# EAGLE design ARTIC_R2 (EAGLE 9.6.2)
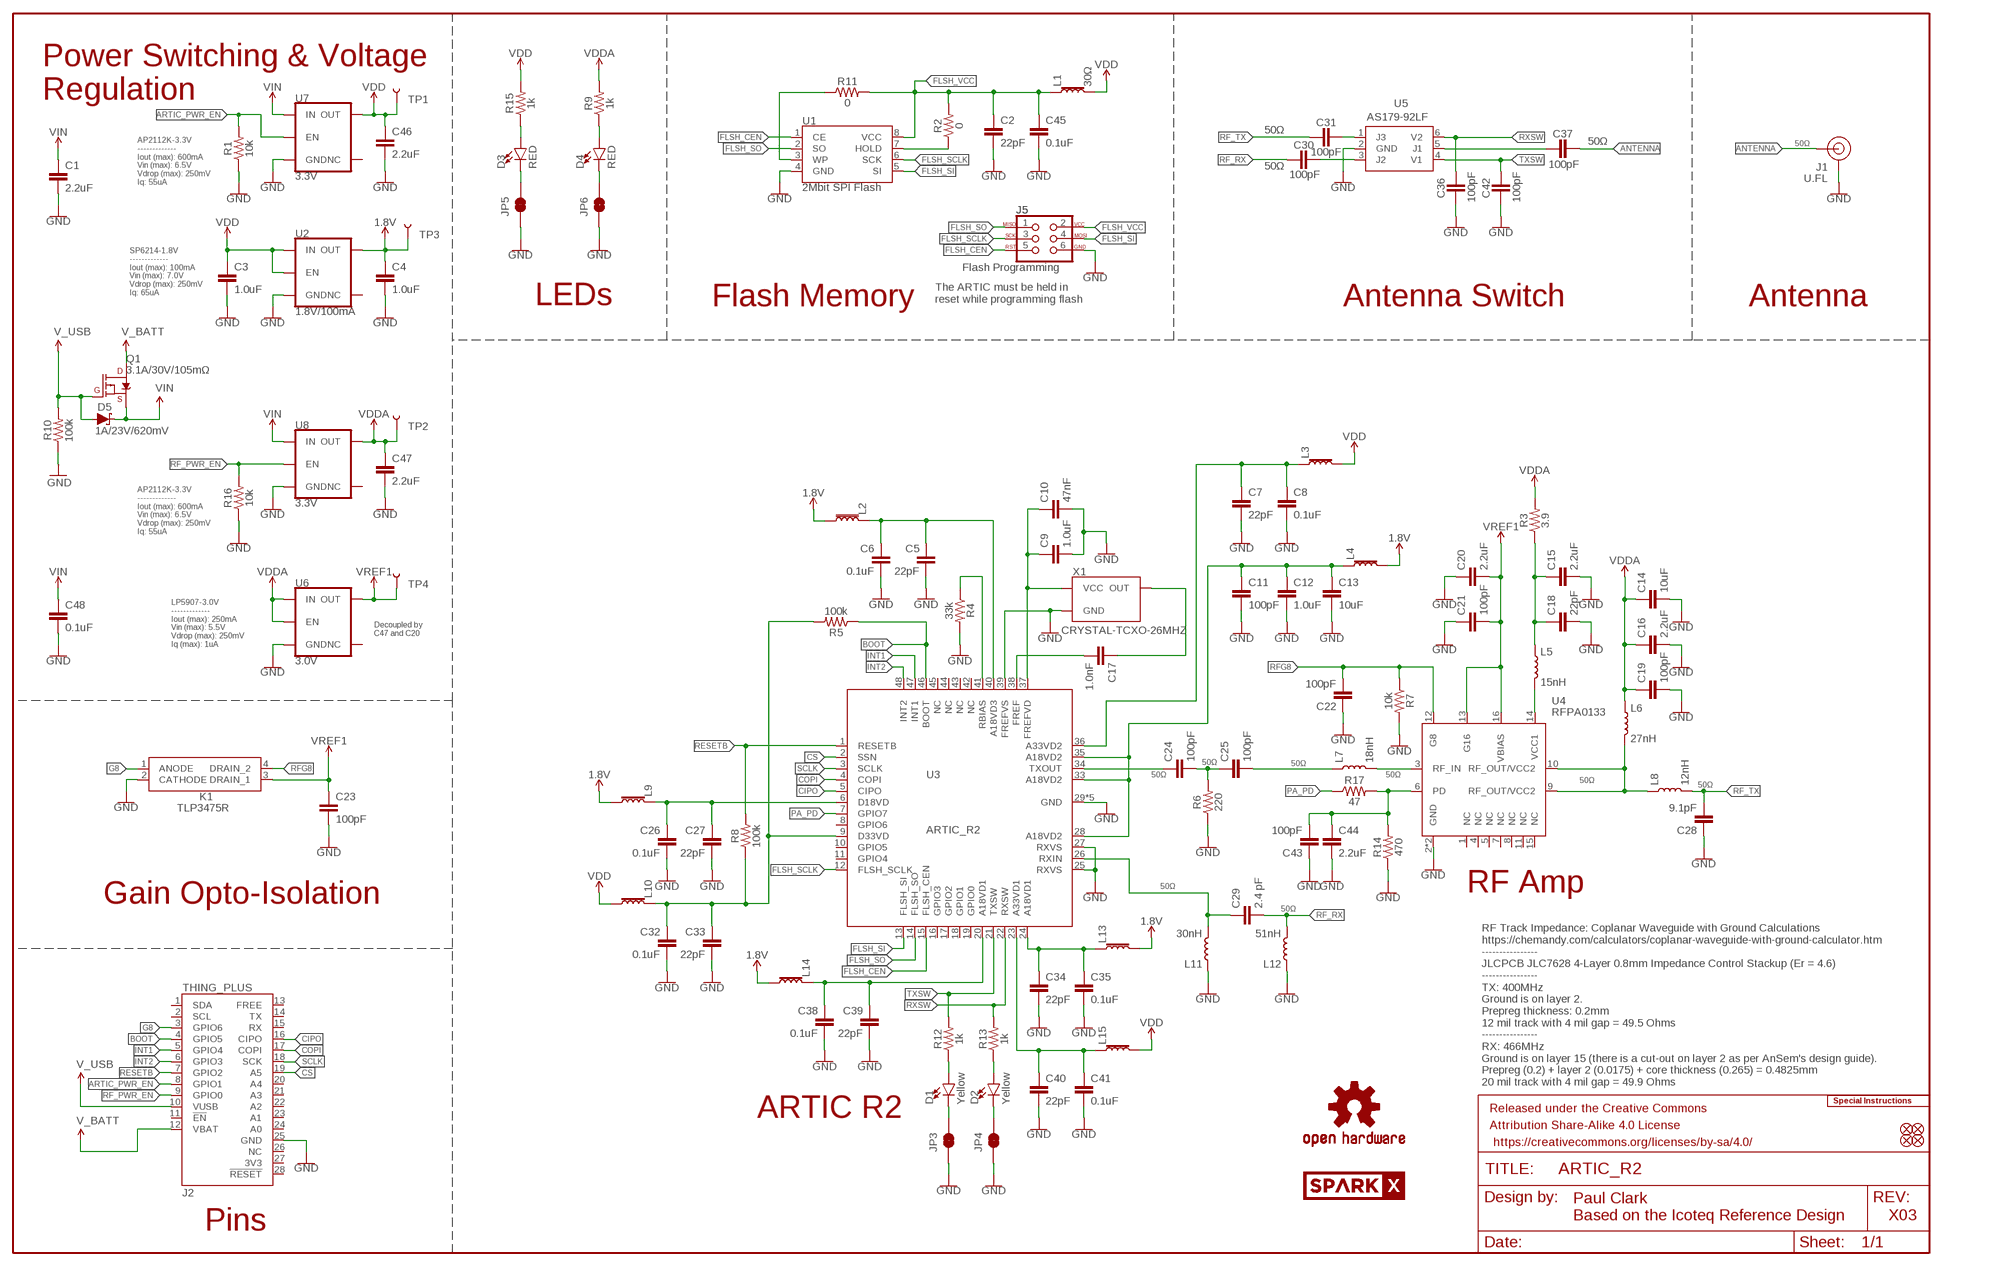
[diagram p0: schematic, sheet 1]

## Parts
C1  2.2uF  2.2UF-0402_TIGHT-10V-10%-X5R  [0402-TIGHT]
C2  22pF  22PF-0402T-16V-10%  [0402-TIGHT]
C3  1.0uF  1.0UF-0402T-16V-10%  [0402-TIGHT]
C4  1.0uF  1.0UF-0402T-16V-10%  [0402-TIGHT]
C5  22pF  22PF-0402T-16V-10%  [0402-TIGHT]
C6  0.1uF  0.1UF-0402T-6.3V-10%-X7R  [0402-TIGHT]
C7  22pF  22PF-0402T-16V-10%  [0402-TIGHT]
C8  0.1uF  0.1UF-0402T-6.3V-10%-X7R  [0402-TIGHT]
C9  1.0uF  1.0UF-0402T-16V-10%  [0402-TIGHT]
C10  47nF  47NF-0402_TIGHT-25V-10%-X7R  [0402-TIGHT]
C11  100pF  100PF-0402T-50V-5%  [0402-TIGHT]
C12  1.0uF  1.0UF-0402T-16V-10%  [0402-TIGHT]
C13  10uF  10UF-0402T-6.3V-20%  [0402-TIGHT]
C14  10uF  10UF-0402T-6.3V-20%  [0402-TIGHT]
C15  2.2uF  2.2UF-0402_TIGHT-10V-10%-X5R  [0402-TIGHT]
C16  2.2uF  2.2UF-0402_TIGHT-10V-10%-X5R  [0402-TIGHT]
C17  1.0nF  1.0NF/1000PF-0402_TIGHT-50V-10%  [0402-TIGHT]
C18  22pF  22PF-0402T-16V-10%  [0402-TIGHT]
C19  100pF  100PF-0402T-50V-5%  [0402-TIGHT]
C20  2.2uF  2.2UF-0402_TIGHT-10V-10%-X5R  [0402-TIGHT]
C21  100pF  100PF-0402T-50V-5%  [0402-TIGHT]
C22  100pF  100PF-0402T-50V-5%  [0402-TIGHT]
C23  100pF  100PF-0402T-50V-5%  [0402-TIGHT]
C24  100pF  100PF-0402T-50V-5%  [0402-TIGHT]
C25  100pF  100PF-0402T-50V-5%  [0402-TIGHT]
C26  0.1uF  0.1UF-0402T-6.3V-10%-X7R  [0402-TIGHT]
C27  22pF  22PF-0402T-16V-10%  [0402-TIGHT]
C28  9.1pF  9.1PF-0402-TIGHT  [0402-TIGHT]
C29  2.4 pF  2.4PF-0402  [0402_MURATA]
C30  100pF  100PF-0402T-50V-5%  [0402-TIGHT]
C31  100pF  100PF-0402T-50V-5%  [0402-TIGHT]
C32  0.1uF  0.1UF-0402T-6.3V-10%-X7R  [0402-TIGHT]
C33  22pF  22PF-0402T-16V-10%  [0402-TIGHT]
C34  22pF  22PF-0402T-16V-10%  [0402-TIGHT]
C35  0.1uF  0.1UF-0402T-6.3V-10%-X7R  [0402-TIGHT]
C36  100pF  100PF-0402T-50V-5%  [0402-TIGHT]
C37  100pF  100PF-0402T-50V-5%  [0402-TIGHT]
C38  0.1uF  0.1UF-0402T-6.3V-10%-X7R  [0402-TIGHT]
C39  22pF  22PF-0402T-16V-10%  [0402-TIGHT]
C40  22pF  22PF-0402T-16V-10%  [0402-TIGHT]
C41  0.1uF  0.1UF-0402T-6.3V-10%-X7R  [0402-TIGHT]
C42  100pF  100PF-0402T-50V-5%  [0402-TIGHT]
C43  100pF  100PF-0402T-50V-5%  [0402-TIGHT]
C44  2.2uF  2.2UF-0402_TIGHT-10V-10%-X5R  [0402-TIGHT]
C45  0.1uF  0.1UF-0402T-6.3V-10%-X7R  [0402-TIGHT]
C46  2.2uF  2.2UF-0402_TIGHT-10V-10%-X5R  [0402-TIGHT]
C47  2.2uF  2.2UF-0402_TIGHT-10V-10%-X5R  [0402-TIGHT]
C48  0.1uF  0.1UF-0402T-10V-10%-X7R  [0402-TIGHT]
D1  Yellow  LED-YELLOW0603  [LED-0603]
D2  Yellow  LED-YELLOW0603  [LED-0603]
D3  RED  LED-RED0603  [LED-0603]
D4  RED  LED-RED0603  [LED-0603]
D5  1A/23V/620mV  DIODE-SCHOTTKY-BAT20J  [SOD-323]
FD1  FIDUCIAL1X2  [FIDUCIAL-1X2]
FD2  FIDUCIAL1X2  [FIDUCIAL-1X2]
FD3  FIDUCIAL1X2  [FIDUCIAL-1X2]
FD4  FIDUCIAL1X2  [FIDUCIAL-1X2]
FRAME1  FRAME-LEDGER  [CREATIVE_COMMONS]
J1  U.FL  U.FL2PIN  [U.FL]
J2  THING_PLUS  [THING_PLUS]
J5  Flash Programming  AVR_SPI_PROG_3X2TESTPOINTS  [2X3_TEST_POINTS]
JP3  JUMPER-SMT_2_NC_TRACE_SILK  [SMT-JUMPER_2_NC_TRACE_SILK]
JP4  JUMPER-SMT_2_NC_TRACE_SILK  [SMT-JUMPER_2_NC_TRACE_SILK]
JP5  JUMPER-SMT_2_NC_TRACE_SILK  [SMT-JUMPER_2_NC_TRACE_SILK]
JP6  JUMPER-SMT_2_NC_TRACE_SILK  [SMT-JUMPER_2_NC_TRACE_SILK]
K1  TLP3475R  [TLP3475RTPF]
L1  30Ω  FERRITE_BEAD-0402-30OHM-100MHZ  [0402-TIGHT]
L2  30Ω  FERRITE_BEAD-0402-30OHM-100MHZ  [0402-TIGHT]
L3  30Ω  FERRITE_BEAD-0402-30OHM-100MHZ  [0402-TIGHT]
L4  30Ω  FERRITE_BEAD-0402-30OHM-100MHZ  [0402-TIGHT]
L5  15nH  15NH-0402  [0402_COILCRAFT]
L6  27nH  27NH-0402  [0402_COILCRAFT]
L7  18nH  18NH-0402  [0402_COILCRAFT]
L8  12nH  12NH-0402  [0402_COILCRAFT]
L9  30Ω  FERRITE_BEAD-0402-30OHM-100MHZ  [0402-TIGHT]
L10  30Ω  FERRITE_BEAD-0402-30OHM-100MHZ  [0402-TIGHT]
L11  30nH  30NH-0402  [0402_COILCRAFT]
L12  51nH  51NH-0402  [0402_COILCRAFT]
L13  30Ω  FERRITE_BEAD-0402-30OHM-100MHZ  [0402-TIGHT]
L14  30Ω  FERRITE_BEAD-0402-30OHM-100MHZ  [0402-TIGHT]
L15  30Ω  FERRITE_BEAD-0402-30OHM-100MHZ  [0402-TIGHT]
LOGO1  SPECIAL_INSTRUCTIONS-ORDERING  [ORDERING_INSTRUCTIONS]
LOGO2  OSHW-LOGOS  [OSHW-LOGO-S]
LOGO3  OSHW-LOGOS  [OSHW-LOGO-S]
Q1  3.1A/30V/105mΩ  MOSFET_PCH-DMG2307L  [SOT23-3]
R1  10k  10KOHM-0402T-1/16W-1%  [0402-TIGHT]
R2  0  0OHM-0402T-1/10W  [0402-TIGHT]
R3  3.9  3.9OHM-0402-TIGHT-1/16W-1%  [0402-TIGHT]
R4  33k  33KOHM-0402T-1/16W-1%  [0402-TIGHT]
R5  100k  100KOHM-0402T-1/16W-1%  [0402-TIGHT]
R6  220  220OHM-0402-TIGHT-1/16W-1%  [0402-TIGHT]
R7  10k  10KOHM-0402T-1/16W-1%  [0402-TIGHT]
R8  100k  100KOHM-0402T-1/16W-1%  [0402-TIGHT]
R9  1k  1KOHM-0402T-1/16W-1%  [0402-TIGHT]
R10  100k  100KOHM-0402T-1/16W-1%  [0402-TIGHT]
R11  0  0OHM-0402T-1/10W  [0402-TIGHT]
R12  1k  1KOHM-0402T-1/16W-1%  [0402-TIGHT]
R13  1k  1KOHM-0402T-1/16W-1%  [0402-TIGHT]
R14  470  470OHM-0402-TIGHT-1/16W-1%  [0402-TIGHT]
R15  1k  1KOHM-0402T-1/16W-1%  [0402-TIGHT]
R16  10k  10KOHM-0402T-1/16W-1%  [0402-TIGHT]
R17  47  47OHM-0402-TIGHT-1/16W-1%  [0402-TIGHT]
SPARKX1  SPARKX-LOGO4  [SPARKX-MEDIUM]
SPARKX2  SPARKX-LOGO4  [SPARKX-MEDIUM]
TP1  TEST-POINTTP_15TH_THRU  [TP_15TH]
TP2  TEST-POINTTP_15TH_THRU  [TP_15TH]
TP3  TEST-POINTTP_15TH_THRU  [TP_15TH]
TP4  TEST-POINTTP_15TH_THRU  [TP_15TH]
U1  2Mbit SPI Flash  SST25VF020BSO08_INDUSTRIAL_TEMP  [SO08]
U2  1.8V/100mA  V_REG_SP6214-1.8V  [SC70]
U3  ARTIC_R2  [QFN-48]
U4  RFPA0133  [QFN50P300X300X86-17N]
U5  AS179-92LF  [SOT65P220X100-6N]
U6  3.0V  V_REG_LP5907SOT23-3.0V  [SOT23-5]
U7  3.3V  V_REG_AP2112K-3.3V  [SOT23-5]
U8  3.3V  V_REG_AP2112K-3.3V  [SOT23-5]
X1  CRYSTAL-TCXO-26MHZ  [CRYSTAL-TCXO-SMD-1.65X1.25]

## Nets
1.8V: C4.1 L2.2 L4.2 L9.2 L13.2 L14.2 TP3.P$1 U2.5(OUT)
ANTENNA: C37.1 J1.FEED(SIGNAL)
ARTIC_PWR_EN: J2.8(GPIO1) R1.2 U7.3(EN)
BOOT: J2.4(GPIO5) R5.1 U3.46(BOOT)
CIPO: J2.16(CIPO) U3.5(CIPO)
COPI: J2.17(COPI) U3.4(COPI)
CS: J2.19(A5) U3.2(SSN)
FLSH_CEN: J5.5 U1.1(CE) U3.15(FLSH_CEN)
FLSH_SCLK: J5.3 U1.6(SCK) U3.12(FLSH_SCLK)
FLSH_SI: J5.4 U1.5(SI) U3.13(FLSH_SI)
FLSH_SO: J5.1 U1.2(SO) U3.14(FLSH_SO)
FLSH_VCC: C2.1 C45.1 J5.2 L1.1 R2.2 R11.2 U1.8(VCC)
G8: J2.3(GPIO6) K1.1(ANODE)
GND: C1.2 C2.2 C3.2 C4.2 C5.2 C6.2 C7.2 C8.2 C9.2 C10.2 C11.2 C12.2 C13.2 C14.2 C15.2 C16.2 C18.2 C19.2 C20.1 C21.1 C22.1 C23.2 C26.2 C27.2 C28.1 C32.2 C33.2 C34.2 C35.2 C36.2 C38.2 C39.2 C40.2 C41.2 C42.2 C43.1 C44.2 C45.2 C46.2 C47.2 C48.2 J1.1(GND) J1.2(GND) J2.25(GND) J5.6 JP3.1 JP4.1 JP5.1 JP6.1 K1.2(CATHODE) L11.P$1 L12.P$1 R1.1 R4.2 R6.1 R7.2 R10.1 R14.1 R16.1 U1.4(GND) U2.2(GND) U3.25(RXVS) U3.27(RXVS) U3.29(GND) U3.30(GND) U3.31(GND) U3.32(GND) U3.39(FREFVS) U3.GND U4.2(GND) U4.EDAP(GND) U5.2(GND) U6.2(GND) U7.2(GND) U8.2(GND) X1.1(GND) X1.2(GND)
INT1: J2.5(GPIO4) U3.47(INT1)
INT2: J2.6(GPIO3) U3.48(INT2)
N$2: R2.1 U1.7(HOLD)
N$3: R11.1 U1.3(WP)
N$4: C34.1 C35.1 L13.1 U3.24(A18VD1)
N$5: C40.1 C41.1 L15.1 U3.23(A33VD1)
N$6: D2.A R13.1
N$7: D1.A R12.1
N$8: C26.1 C27.1 L9.1 U3.6(D18VD)
N$9: C32.1 C33.1 L10.1 R5.2 R8.1 U3.9(D33VD)
N$10: C11.1 C12.1 C13.1 L4.1 U3.28(A18VD2) U3.33(A18VD2) U3.35(A18VD2)
N$11: C7.1 C8.1 L3.1 U3.36(A33VD2)
N$12: R4.1 U3.41(RBIAS)
N$13: C5.1 C6.1 L2.1 U3.40(A18VD3)
N$14: C9.1 C10.1 U3.37(FREFVD) X1.4(VCC)
N$15: C17.1 X1.3(OUT)
N$16: C17.2 U3.38(FREF)
N$17: C24.1 U3.34(TXOUT)
N$18: C24.2 C25.1 R6.2
N$19: L5.P$2 U4.14(VCC1)
N$20: C15.1 C18.1 L5.P$1 R3.1
N$21: C29.P$1 L11.P$2 U3.26(RXIN)
N$22: D4.A R9.1
N$24: C25.2 L7.P$1
N$25: L7.P$2 U4.3(RF_IN)
N$26: L6.P$2 L8.P$1 U4.9(RF_OUT/VCC2) U4.10(RF_OUT/VCC2)
N$27: D4.C JP6.2
N$28: C31.1 U5.1(J3)
N$29: C30.1 U5.3(J2)
N$30: C37.2 U5.5(J1)
N$31: C38.1 C39.1 L14.1 U3.20(A18VD1)
N$35: D1.C JP3.2
N$36: D2.C JP4.2
N$37: D3.A R15.1
N$38: D3.C JP5.2
PA_PD: R17.1 U3.7(GPIO7)
PD: C43.2 C44.1 R14.2 R17.2 U4.6(PD)
RESETB: J2.7(GPIO2) R8.2 U3.1(RESETB)
RF_PWR_EN: J2.9(GPIO0) R16.2 U8.3(EN)
RF_RX: C29.P$2 C30.2 L12.P$2
RF_TX: C28.2 C31.2 L8.P$2
RFG8: C22.2 K1.4(DRAIN_2) R7.1 U4.12(G8)
RXSW: C36.1 R13.2 U3.22(RXSW) U5.6(V2)
SCLK: J2.18(SCK) U3.3(SCLK)
TXSW: C42.1 R12.2 U3.21(TXSW) U5.4(V1)
V_BATT: J2.12(VBAT) Q1.3(D)
V_USB: D5.A J2.10(VUSB) Q1.1(G) R10.2
VDD: C3.1 C46.1 L1.2 L3.2 L10.2 L15.2 R15.2 TP1.P$1 U2.1(IN) U2.3(EN) U7.5(OUT)
VDDA: C14.1 C16.1 C19.1 C47.1 L6.P$1 R3.2 R9.2 TP2.P$1 U6.1(IN) U6.3(EN) U8.5(OUT)
VIN: C1.1 C48.1 D5.C Q1.2(S) U7.1(IN) U8.1(IN)
VREF1: C20.2 C21.2 C23.1 K1.3(DRAIN_1) TP4.P$1 U4.13(G16) U4.16(VBIAS) U6.5(OUT)
Unconnected: J2.1(SDA) J2.2(SCL) J2.11(!EN) J2.13(FREE) J2.14(TX) J2.15(RX) J2.20(A4) J2.21(A3) J2.22(A2) J2.23(A1) J2.24(A0) J2.26(NC) J2.27(3V3) J2.28(!RESET) U2.4(NC) U3.8(GPIO6) U3.10(GPIO5) U3.11(GPIO4) U3.16(GPIO3) U3.17(GPIO2) U3.18(GPIO1) U3.19(GPIO0) U3.42(NC) U3.43(NC) U3.44(NC) U3.45(NC) U4.1(NC) U4.4(NC) U4.5(NC) U4.7(NC) U4.8(NC) U4.11(NC) U4.15(NC) U6.4(NC) U7.4(NC) U8.4(NC)

## Notes on the sheet
- Power Switching & Voltage
  Regulation
- 50Ω
- AP2112K-3.3V
  -------------
  Iout (max): 600mA 
  Vin (max): 6.5V
  Vdrop (max): 250mV
  Iq: 55uA
- 50Ω | 50Ω
- 50Ω
- SP6214-1.8V
  -------------
  Iout (max): 100mA 
  Vin (max): 7.0V
  Vdrop (max): 250mV
  Iq: 65uA
- The ARTIC must be held in
  reset while programming flash
- LEDs | Flash Memory | Antenna Switch | Antenna
- AP2112K-3.3V
  -------------
  Iout (max): 600mA 
  Vin (max): 6.5V
  Vdrop (max): 250mV
  Iq: 55uA
- LP5907-3.0V
  -------------
  Iout (max): 250mA 
  Vin (max): 5.5V
  Vdrop (max): 250mV
  Iq (max): 1uA
- Decoupled by
  C47 and C20
- 50Ω | 50Ω
- 50Ω | 50Ω
- 50Ω
- 50Ω
- 50Ω
- RF Amp
- Gain Opto-Isolation
- 50Ω
- RF Track Impedance: Coplanar Waveguide with Ground Calculations
  https://chemandy.com/calculators/coplanar-waveguide-with-ground-calculator.htm
  ----------------
  JLCPCB JLC7628 4-Layer 0.8mm Impedance Control Stackup (Er = 4.6)
  ----------------
  TX: 400MHz
  Ground is on layer 2.
  Prepreg thickness: 0.2mm
  12 mil track with 4 mil gap = 49.5 Ohms
  ----------------
  RX: 466MHz
  Ground is on layer 15 (there is a cut-out on layer 2 as per AnSem's design guide).
  Prepreg (0.2) + layer 2 (0.0175) + core thickness (0.265) = 0.4825mm
  20 mil track with 4 mil gap = 49.9 Ohms
- ARTIC R2
- Paul Clark
  Based on the Icoteq Reference Design
- X03
- Pins

## Library data of the parts
C1 C15 C16 C20 C44 C46 C47 = SparkFun-Capacitors:2.2UF: 2.2µF ceramic capacitors A capacitor is a passive two-terminal electrical component used to store electrical energy temporarily in an electric field.; PROD_ID: CAP-14232
C2 C5 C7 C18 C27 C33 C34 C39 C40 = SparkFun-Capacitors:22PF: 22pF ceramic capacitors A capacitor is a passive two-terminal electrical component used to store electrical energy temporarily in an electric field.; PROD_ID: CAP-14674
C3 C4 C9 C12 = SparkFun-Capacitors:1.0UF: 1µF ceramic capacitors A capacitor is a passive two-terminal electrical component used to store electrical energy temporarily in an electric field.; PROD_ID: CAP-12417
C6 C8 C26 C32 C35 C38 C41 C45 = SparkFun-Capacitors:0.1UF: 0.1µF ceramic capacitors A capacitor is a passive two-terminal electrical component used to store electrical energy temporarily in an electric field.; PROD_ID: CAP-14993
C10 = SparkFun-Capacitors:47NF: 47nF ceramic capacitors A capacitor is a passive two-terminal electrical component used to store electrical energy temporarily in an electric field.; PROD_ID: CAP-14243
C11 C19 C21-C25 C30 C31 C36 C37 C42 C43 = SparkFun-Capacitors:100PF: 100pF/0.1nF ceramic capacitors A capacitor is a passive two-terminal electrical component used to store electrical energy temporarily in an electric field.; PROD_ID: CAP-13458
C13 C14 = SparkFun-Capacitors:10UF: 10.0µF ceramic capacitors A capacitor is a passive two-terminal electrical component used to store electrical energy temporarily in an electric field.; PROD_ID: CAP-14848
C17 = SparkFun-Capacitors:1.0NF/1000PF: 1nF/1,000pF ceramic capacitors A capacitor is a passive two-terminal electrical component used to store electrical energy temporarily in an electric field.; PROD_ID: CAP-14280
C28 = SparkFun-Capacitors:9.1PF: 9.1pF ceramic capacitors A capacitor is a passive two-terminal electrical component used to store electrical energy temporarily in an electric field.; MOUSER_PART: 609-500R07S9R1CV4T; PROD_ID: CAP-15278
C29 = SparkFun-Capacitors:2.4PF; PROD_ID: CAP-14351
C48 = SparkFun-Capacitors:0.1UF: 0.1µF ceramic capacitors A capacitor is a passive two-terminal electrical component used to store electrical energy temporarily in an electric field.; PROD_ID: CAP-15083
D1 D2 = SparkFun-LED:LED-YELLOW: Yellow SMD LED Used in manufacturing several products at SparkFun. Packages: 0603 - SMD 0603 package[Product Link] <http://www.kingbrightusa.com/product.asp?catalog_name=LED&product_id=APT1608SYCK> 0603 -SMART - SMART SMD 0603 package (more efficient/more expensive) [Product Link] <http://www.osram-os.com/osram_os/en/products/product-catalog/led-light-emitting-diodes/smartled-0603/ly-l29k/index.jsp> LilyPad - SMD1206 package[Product Datasheet] <https://www.sparkfun.com/datasheets/DevTools/LilyPad/Q150YUS4.pdf> SparkFun Products: Blynk Board <https://www.sparkfun.com/products/13794> IOIO-OTG <https://www.sparkfun.com/products/13613> XBee Explorer Serial <https://www.sparkfun.com/products/13225>; PROD_ID: DIO-09003
D3 D4 = SparkFun-LED:LED-RED: Red SMD LED Used in manufacturing of most products at SparkFun Packages: 0603 - SMD 0603 package [Product Link] <http://docs.avagotech.com/docs/AV02-0551EN> 0603 SMART - SMD 0603 SMART package ( more efficient and expensive)[Product Link] <http://www.osram-os.com/Graphics/XPic2/00077099_0.pdf> 1206 - SMD1206 package [Product Link] <https://www.sparkfun.com/datasheets/DevTools/LilyPad/Q150OVS4.pdff> SparkFun Products: Pro Mini 328 -5V <https://www.sparkfun.com/products/821> RedBoard <https://www.sparkfun.com/products/12757> IOIO-OTG <https://www.sparkfun.com/products/13613>; PROD_ID: DIO-00819
D5 = SparkFun-DiscreteSemi:DIODE-SCHOTTKY: Schottky diode A Schottky diode is a semiconductor diode which has a low forward voltage drop and a very fast switching action.; PROD_ID: DIO-11623
FD1-FD4 = SparkFun-Aesthetics:FIDUCIAL: Fiducial Alignment Points Point-of-reference for pick-and-place machines and other optical instruments.
FRAME1 = SparkFun-Aesthetics:FRAME-LEDGER: Schematic Frame - Ledger Standard 11x14 US Ledger frame
J1 = SparkFun-Connectors:U.FL2PIN: SMD Antenna Connector - U.FL 2mm height, 3.0mm x 3.0mm receptacle size. SparkFun Products: SparkFun WiFi Shield - ESP8266 <https://www.sparkfun.com/products/13287> SparkFun ESP8266 Thing <https://www.sparkfun.com/products/13231> SparkFun MiniGen - Pro Mini Signal Generator Shield <https://www.sparkfun.com/products/11420>; PROD_ID: CONN-09193; SF_ID: WRL-09144
J2 = New_Parts_Boards:THING_PLUS
J5 = SparkFun-Connectors:AVR_SPI_PROG_3X2: AVR ISP 6 Pin This is the reduced ISP connector for AVR programming. Common on Arduino. This footprint will take up less PCB space and can be used with a 10-pin to 6-pin adapter such as SKU: BOB-08508 **Special note about "TEST_POINT" package. The stop mask is on the top side, so if you want your programming test points to be on the bottom of your board, make sure to place this package on the bottom side of the board. This also ensure that the orientation to program from the bottom side will be correct. SparkFun Products: SparkFun ISP Pogo Adapter <https://www.sparkfun.com/products/11591> - NS Tiny AVR Programmer <https://www.sparkfun.com/products/11801> -PTH
JP3-JP6 = SparkFun-Jumpers:JUMPER-SMT_2_NC_TRACE: Normally closed trace jumper This jumper has a trace between two pads so it's normally closed (NC). Use a razor knife to open the connection. For best results follow the IPC guidelines for cutting traces: Cutout at least 0.063 mm (0.005 in). Remove all loose material to clean up the cut area. Seal the cut with an approved epoxy. Reapply solder to reclose the connection.
K1 = SparkFun-DiscreteSemi:TLP3475R: Solid State Relays - PCB Mount Photo-IC 300mA 50V 500Vrms Source: Datasheet <http://toshiba.semicon-storage.com/info/docget.jsp?did=55304&prodName=TLP3475R> OBSOLETE - use TLP3475SRHA; DESCRIPTION: Solid State Relays - PCB Mount Photo-IC 300mA 50V 500Vrms; DIGIKEY_PART: TLP3475R(TPFCT-ND - Cut Tape (CT); MANUFACTURER_NAME: Toshiba; MANUFACTURER_PART_NUMBER: TLP3475R; PROD_ID: IC-15447
L1-L4 L9 L10 L13-L15 = SparkFun-Coils:FERRITE_BEAD: Ferrite Bead (blocks, cores, rings, chokes, etc.) Inductor with layers of ferrite used to suppress high frequencies. Often used to isolate high frequency noise. SparkFun Products: IOIO-OTG - V2.2 <https://www.sparkfun.com/products/13613> SparkFun SAMD21 Mini Breakout <https://www.sparkfun.com/products/13664> SparkFun 6 Degrees of Freedom Breakout - LSM6DS3 <https://www.sparkfun.com/products/13339> SparkFun SAMD21 Dev Breakout <https://www.sparkfun.com/products/13672>; PROD_ID: NDUC-15133
L5 = SparkFun-Coils:15NH; MOUSER_PART: 994-0402HP-15NXGLU; PROD_ID: NDUC-15272
L6 = SparkFun-Coils:27NH; MOUSER_PART: 994-0402HP-27NXGLU; PROD_ID: NDUC-15273
L7 = SparkFun-Coils:18NH; MOUSER_PART: 994-0402HP-18NXGLU; PROD_ID: NDUC-15277
L8 = SparkFun-Coils:12NH; MOUSER_PART: 994-0402HP-12NXGLU; PROD_ID: NDUC-15271
L11 = SparkFun-Coils:30NH; MOUSER_PART: 994-0402HP-30NXGLU; PROD_ID: NDUC-15275
L12 = SparkFun-Coils:51NH; MOUSER_PART: 994-0402HP-51NXGLU; PROD_ID: NDUC-15276
LOGO1 = SparkFun-Aesthetics:SPECIAL_INSTRUCTIONS: Special Ordering/Production Instructions Alert Symbol for special PCB ordering instructions or unique production process warnings. Ordering Instructions Production Instructions Types of information that should be added to box: Copper weight Soldermask color Silk color PCB thickness Number of layers PCB Standard: 1.6mm FR4 1 oz copper immersion silver plating red soldermask white silkscreen Types of information that should be added to box: Special wash requirements Depaneling instructions Humidification Glue curing Default text settings: 0.07 inch 9% ratio 50% line distance
LOGO2 LOGO3 = SparkFun-Aesthetics:OSHW-LOGO: Open-Source Hardware (OSHW) Logo This logo indicates the piece of hardware it is found on incorporates a OSHW license and/or adheres to the definition of open source hardware found here: http://freedomdefined.org/OSHW
Q1 = SparkFun-DiscreteSemi:MOSFET_PCH: P-channel MOSFETs Voltage controlled devices that allow control of high current outputs. SparkFun Products: SparkFun ESP32 Thing <https://www.sparkfun.com/products/13907> SparkFun ESP8266 Thing <https://www.sparkfun.com/products/13231> SparkFun Pi Servo HAT V2 <https://www.sparkfun.com/products/15316> DMG2305UX-7 (20V/4.2A/SOT23-3); PROD_ID: TRANS-11308
R1 R7 R16 = SparkFun-Resistors:10KOHM: 10kΩ resistor A resistor is a passive two-terminal electrical component that implements electrical resistance as a circuit element. Resistors act to reduce current flow, and, at the same time, act to lower voltage levels within circuits. - Wikipedia; PROD_ID: RES-14241
R2 R11 = SparkFun-Resistors:0OHM: 0Ω resistor A resistor is a passive two-terminal electrical component that implements electrical resistance as a circuit element. Resistors act to reduce current flow, and, at the same time, act to lower voltage levels within circuits. - Wikipedia; PROD_ID: RES-14244
R3 = SparkFun-Resistors:3.9OHM: 3.9Ω resistor A resistor is a passive two-terminal electrical component that implements electrical resistance as a circuit element. Resistors act to reduce current flow, and, at the same time, act to lower voltage levels within circuits. - Wikipedia; PROD_ID: RES-15270
R4 = SparkFun-Resistors:33KOHM: 33kΩ resistor A resistor is a passive two-terminal electrical component that implements electrical resistance as a circuit element. Resistors act to reduce current flow, and, at the same time, act to lower voltage levels within circuits. - Wikipedia; PROD_ID: RES-15128
R5 R8 R10 = SparkFun-Resistors:100KOHM: 100kΩ resistor A resistor is a passive two-terminal electrical component that implements electrical resistance as a circuit element. Resistors act to reduce current flow, and, at the same time, act to lower voltage levels within circuits. - Wikipedia; PROD_ID: RES-13495
R6 = SparkFun-Resistors:220OHM: 220Ω resistor A resistor is a passive two-terminal electrical component that implements electrical resistance as a circuit element. Resistors act to reduce current flow, and, at the same time, act to lower voltage levels within circuits. - Wikipedia; PROD_ID: RES-15269
R9 R12 R13 R15 = SparkFun-Resistors:1KOHM: 1kΩ resistor A resistor is a passive two-terminal electrical component that implements electrical resistance as a circuit element. Resistors act to reduce current flow, and, at the same time, act to lower voltage levels within circuits. - Wikipedia; PROD_ID: RES-14342
R14 = SparkFun-Resistors:470OHM: 470Ω resistor A resistor is a passive two-terminal electrical component that implements electrical resistance as a circuit element. Resistors act to reduce current flow, and, at the same time, act to lower voltage levels within circuits. - Wikipedia; PROD_ID: RES-15584
R17 = SparkFun-Resistors:47OHM: 47Ω resistor A resistor is a passive two-terminal electrical component that implements electrical resistance as a circuit element. Resistors act to reduce current flow, and, at the same time, act to lower voltage levels within circuits. - Wikipedia; PROD_ID: RES-15585
SPARKX1 SPARKX2 = SparkX:SPARKX-LOGO
TP1-TP4 = SparkFun-Connectors:TEST-POINT: SparkFun Test Points Bare copper test points for troubleshooting or In-Circuit-Testing. These are used by our Production team for verifying production board runs using pogo-pins on test beds. SparkFun Products: SparkFun LSM9DS1 Breakout <https://www.sparkfun.com/products/13284> SparkFun PSOC <https://www.sparkfun.com/products/13714> SparkFun Load Cell Amplifier <https://www.sparkfun.com/products/13879>
U1 = SparkFun-IC-Memory:SST25VF020B: 2Mbit Serial Flash Memory 8pin SPI Flash Datasheet <http://ww1.microchip.com/downloads/en/DeviceDoc/20005054D.pdf>; DIGIKEY_PART: SST25VF020B-80-4I-SAE-TCT-ND; MANUFACTURER: Microchip; MANU_PART: SST25VF020B-80-4I-SAE-T; MOUSER_PART: 579-25VF020B8ISAET; PROD_ID: IC-15319
U2 = SparkFun-IC-Power:V_REG_SP6214: Voltage Regulator - SP6214 SP6214 Series SC-70-5 Micropower SC-70 100 mA CMOS LDO Regulator Datasheet <https://www.exar.com/content/document.ashx?id=654> SparkFun Products: MP3 Trigger <https://www.sparkfun.com/products/13720> SparkFun Particle Sensor Breakout <https://www.sparkfun.com/products/14045>; PROD_ID: VREG-08428
U3 = SparkFun-RF:ARTIC_R2: AnSem ARTIC R2 Chipset The ARTIC is an integrated low power small size ARGOS 2/3/4 single chip radio. ARTIC implements a message based wireless interface. For satellite uplink communication, ARTIC will encode, modulate and transmit provided user messages. For downlink communication, ARTIC will lock to the downstream, demodulate and decode and extract the satellite messages. The ARTIC can transmit signals in frequency bands around 400MHz and receive signals in the bands around 466MHz, in accordance with the ARGOS satellite system specifications. The ARTIC is compliant and certified for all ARGOS 2 and ARGOS 3 TX standards. It contains a RF transceiver, afrequency synthesizer and a digital baseband modem. The ARTIC contains an on-chip power amplifier delivering 1mW [0dBm] output power, that serves as an output for connecting an external high efficient PA. The (de)modulation algorithms run on an on-chip DSP. This software approach allows for retargeting the ARTIC for other applications. The DSP program can be retained on an external flash or the MCU.; PROD_ID: IC-15312
U4 = SparkFun-RF:RFPA0133: IC PROG PWR AMP 16-QFN Source: Datasheet <http://www.qorvo.com/products/d/da000936>; MANUFACTURER_NAME: Qorvo; MANUFACTURER_PART_NUMBER: RFPA0133TR7; MOUSER_PART_NUMBER: 772-RFPA0133; PROD_ID: IC-15274
U5 = SparkFun-RF:AS179-92LF: SKYWORKS SOLUTIONS - AS179-92LF - IC, SWITCH, RF, SPDT, 0.02-3.0GHZ Source: Datasheet <http://www.skyworksinc.com/uploads/documents/AS179_92LF_200176H.pdf>; PROD_ID: IC-15047
U6 = SparkFun-IC-Power:V_REG_LP5907: LP5907 - 250mA Ultra-Low-Noise LDO Regulator w/ Enable The LP5907 is a low-noise LDO that can supply up to 250 mA output current. Designed to meet the requirements of RF and analog circuits, the LP5907 device provides low noise, high PSRR, low quiescent current, and low line or load transient response figures. Using new innovative design techniques, the LP5907 offers class-leading noise performance without a noise bypass capacitor and the ability for remote output capacitor placement. The device is designed to work with a 1-µF input and a 1-µF output ceramic capacitor (no separate noise bypass capacitor is required). This device is available with fixed output voltages from 1.2 V to 4.5 V in 25-mV steps.; DIGIKEY_PART: 296-40357-1-ND; MANU_PART: LP5907MFX-3.0/NOPB; MOUSER_PART: 595-LP5907MFX-3.0NPB; PACKAGE: SOT-23(5); PROD_ID: VREG-15586
U7 U8 = SparkFun-IC-Power:V_REG_AP2112: AP2112 - 600mA CMOS LDO Regulator w/ Enable The AP2112 is CMOS process low dropout linear regulator with enable function, the regulator delivers a guaranteed 600mA (min.) continuous load current. Features Output Voltage Accuracy: ±1.5% Output Current: 600mA (Min.) Foldback Short Current Protection: 50mA Enable Function to Turn ON/OFF VOUT Low Dropout Voltage (3.3V): 250mV (Typ.) @IOUT=600mA Excellent Load Regulation: 0.2%/A (Typ.) Excellent Line Regulation: 0.02%/V (Typ.) Low Quiescent Current: 55μA (Typ.) Low Standby Current: 0.01μA (Typ.) Low Output Noise: 50μVRMS PSRR: 100Hz -65dB, 1kHz -65dB OTSD Protection Stable with 1.0μF Flexible Cap: Ceramic, Tantalum and Aluminum Electrolytic Operation Temperature Range: -40°C to 85°C ESD: MM 400V, HBM 4000V; PROD_ID: VREG-12457
X1 = SparkFun-Clocks:CRYSTAL-TCXO-26MHZ: 26MHz Crystal Oscillator IQXT-350 LFTCXO073004CUTT Datasheet <https://www.mouser.co.uk/datasheet/2/741/iqxt-350-1-33-1075257.pdf> Frequency: 26MHz Frequency Stability: ±0.50ppm Frequency Tolerance: ±1.50ppm; MOUSER_PART: 449-LFTCXO073004CUTT; PROD_ID: XTAL-15279

## Net classes
1 Power: width 0.305 mm

## Board
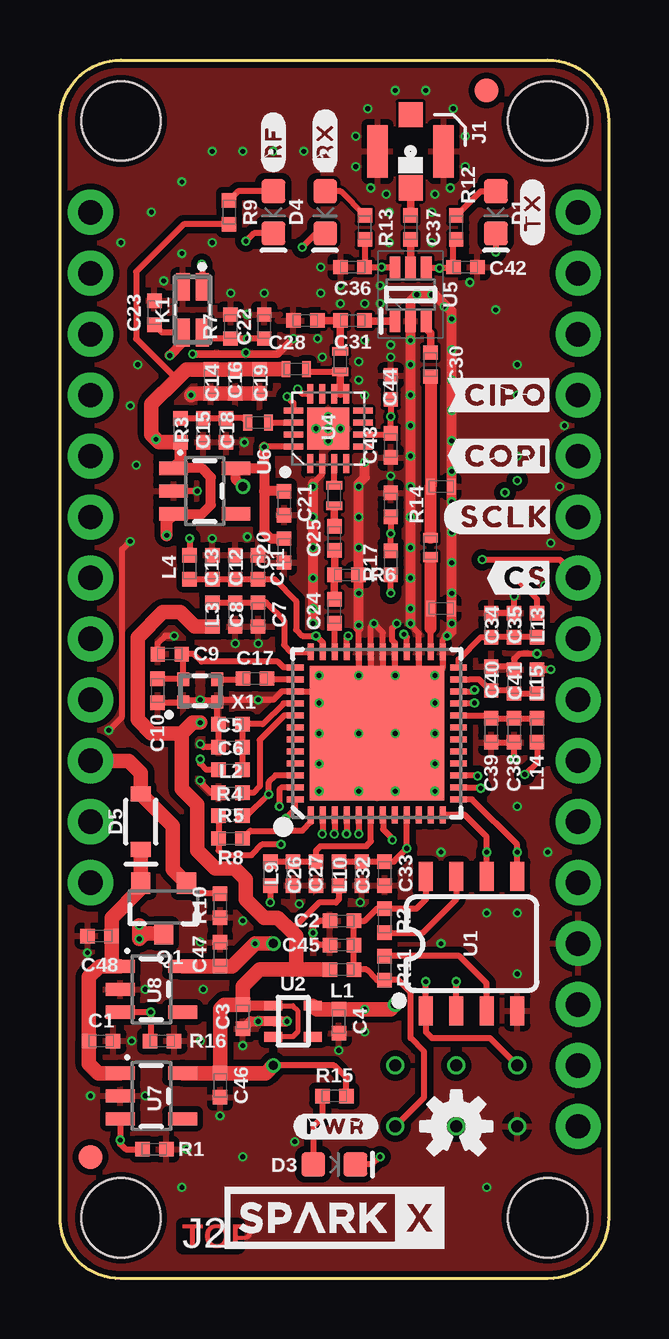
[diagram p1: board, top side]
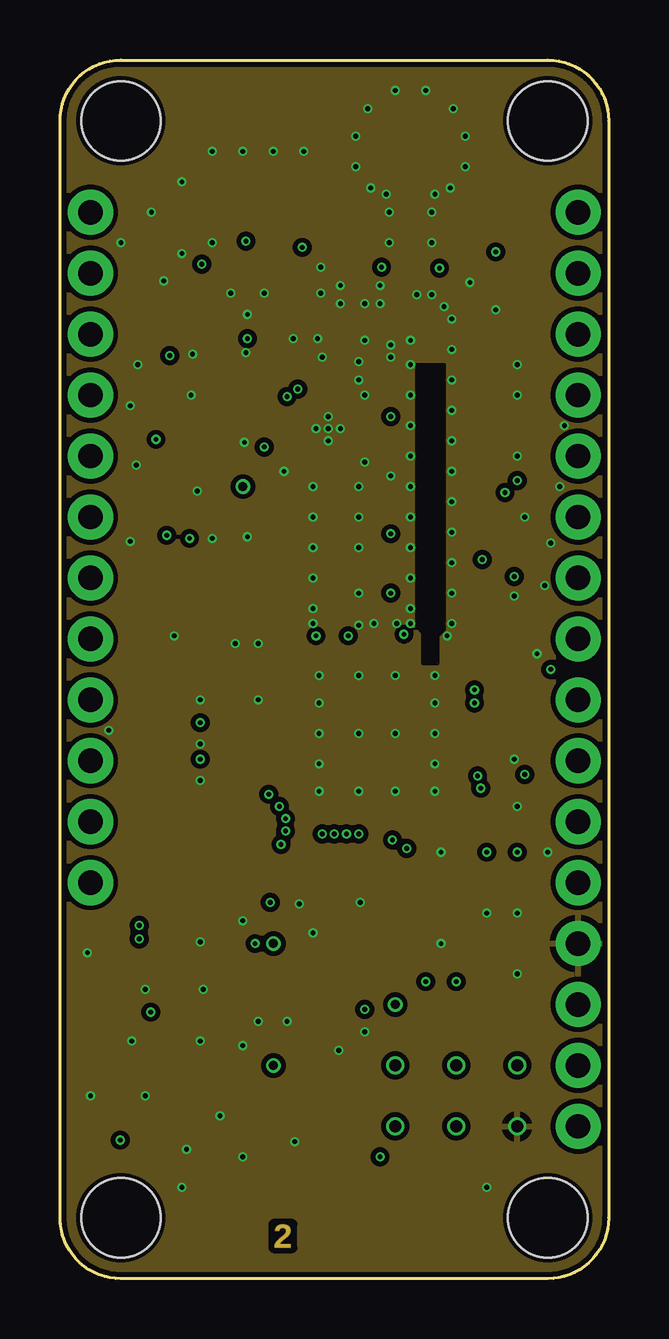
[diagram p2: board, inner layer Route2]
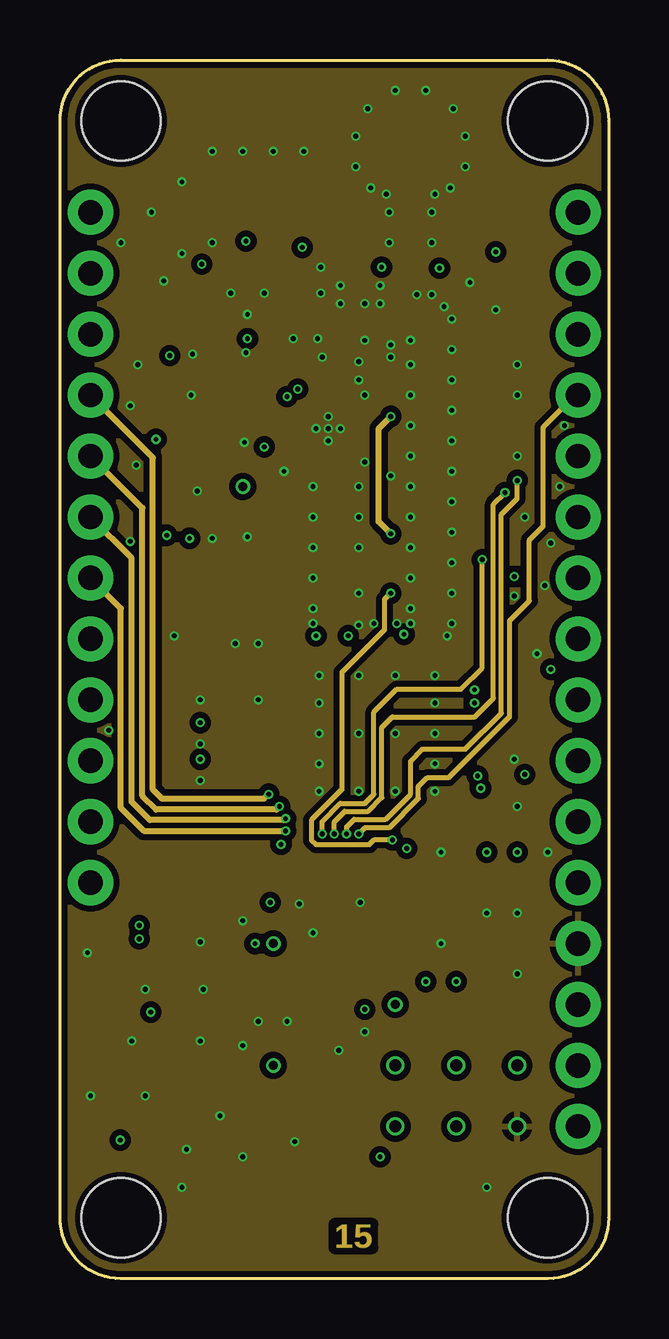
[diagram p3: board, inner layer Route15]
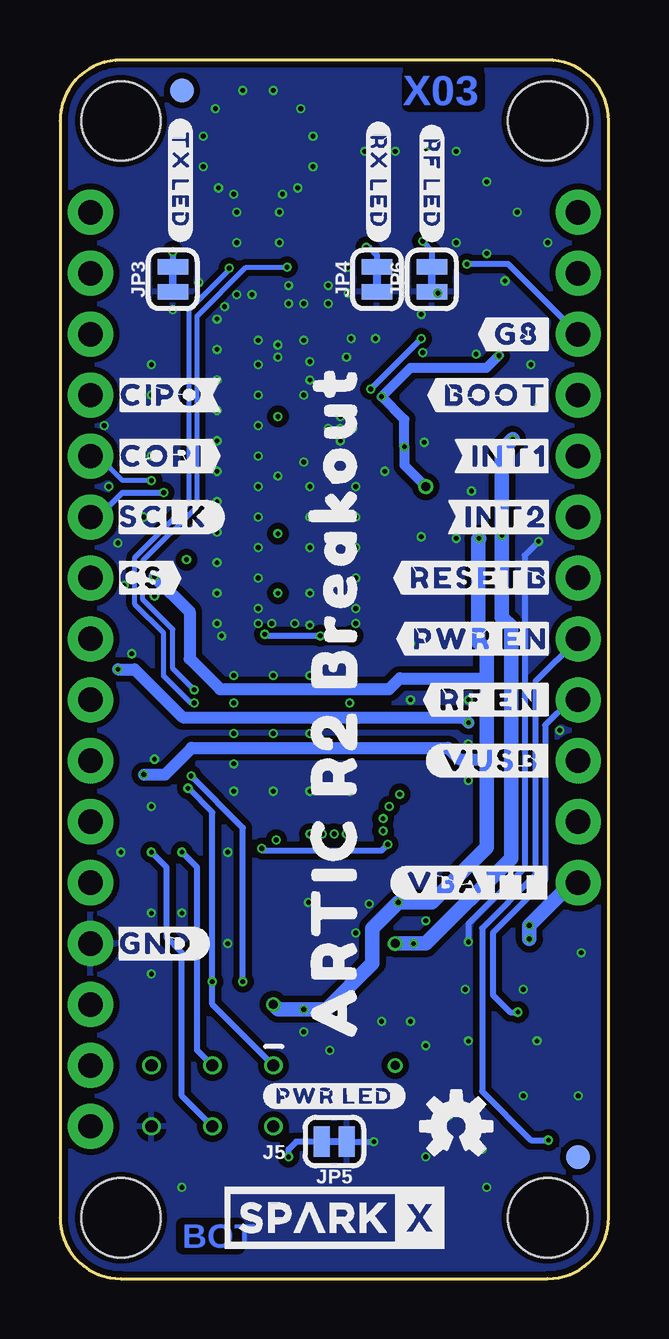
[diagram p4: board, bottom side, seen from below]

Size 22.86 x 50.8 mm. Coordinates in mm from the lower left corner, seen from the top.
Outline: 0,48.26 0,2.54 arc90 2.54,0 20.32,0 arc90 22.86,2.54 22.86,48.26 arc90 20.32,50.8 2.54,50.8 arc90 0,48.26
Copper layers (1+2*15+16): Top 0.035mm / dielectric 0.2mm / Route2 0.0175mm / dielectric 0.265mm / Route15 0.0175mm / dielectric 0.2mm / Bottom 0.035mm
Design rules "SparkFun-4_layer-Impedance_Control-JLCPCB-JLC7628": minimum track width 5mil, minimum drill 0.2mm, track to track 5mil, track to pad 5mil, pad to pad 5mil, via to via 5mil, smd to smd 0mil, copper to edge 5mil, drill to drill 5mil, minimum pad ring 3.5mil, minimum via ring 3.5mil, stop-mask expansion 4mil, vias tented up to drill 25mil, thermal gap 10mil
tRestrict: area 14,46.1 to 15.2,47.9

### Footprints (pad centres in the part's own frame; a part is rotated, then mirrored left to right if it is on the bottom)
0402-TIGHT = smd 0.6 x 0.6: 1 -0.5,0; 2 0.5,0
0402_MURATA = smd 0.4 x 0.6: P$1 -0.4,0; P$2 0.4,0
LED-0603 = smd 1 x 1: A -0.877,0; C 0.877,0
SOD-323 = smd 0.63 x 0.83: A 1.15,0; C -1.15,0
FIDUCIAL-1X2 = smd 1 x 1: 1 0,0
U.FL = smd 2.2 x 0.85: 1 0,1.375; 2 0,-1.375 | smd 1.05 x 1: FEED 1.525,0; NC -1.525,0
THING_PLUS = drill 1.016 pad 1.88: 1 -10.16,19.05; 2 -10.16,16.51; 3 -10.16,13.97; 4 -10.16,11.43; 5 -10.16,8.89; 6 -10.16,6.35; 7 -10.16,3.81; 8 -10.16,1.27; 9 -10.16,-1.27; 10 -10.16,-3.81; 11 -10.16,-6.35; 12 -10.16,-8.89; 13 10.16,19.05; 14 10.16,16.51; 15 10.16,13.97; 16 10.16,11.43; 17 10.16,8.89; 18 10.16,6.35; 19 10.16,3.81; 20 10.16,1.27; 21 10.16,-1.27; 22 10.16,-3.81; 23 10.16,-6.35; 24 10.16,-8.89; 25 10.16,-11.43; 26 10.16,-13.97; 27 10.16,-16.51; 28 10.16,-19.05 | hole 3.302: -8.89,-22.86; 8.89,-22.86; 8.89,22.86; -8.89,22.86
2X3_TEST_POINTS = drill 0.508: 1 -2.54,-1.27; 2 -2.54,1.27; 3 0,-1.27; 4 0,1.27; 5 2.54,-1.27; 6 2.54,1.27
SMT-JUMPER_2_NC_TRACE_SILK = smd 0.66 x 1.27: 1 -0.521,0; 2 0.521,0
TLP3475RTPF = smd 1.15 x 0.55: 1 -0.95,0.4; 2 -0.95,-0.4; 3 0.95,-0.4; 4 0.95,0.4
0402_COILCRAFT = smd 0.356 x 0.66: P$1 -0.432,0; P$2 0.432,0
SOT23-3 = smd 0.8 x 0.9: 1 -0.95,-1; 2 0.95,-1; 3 0,1.1
TP_15TH = drill 0.381 pad 0.61: P$1 0,0
SO08 = smd 0.6 x 1.2: 1 -1.905,-2.8; 2 -0.635,-2.8; 3 0.635,-2.8; 4 1.905,-2.8; 5 1.905,2.8; 6 0.635,2.8; 7 -0.635,2.8; 8 -1.905,2.8
SC70 = smd 0.4 x 0.75: 1 -0.65,-0.825; 2 0,-0.825; 3 0.65,-0.825; 4 0.65,0.825; 5 -0.65,0.825
QFN-48 = smd 0.7 x 0.25: 1 -3.4,2.75; 2 -3.4,2.25; 3 -3.4,1.75; 4 -3.4,1.25; 5 -3.4,0.75; 6 -3.4,0.25; 7 -3.4,-0.25; 8 -3.4,-0.75; 9 -3.4,-1.25; 10 -3.4,-1.75; 11 -3.4,-2.25; 12 -3.4,-2.75; 25 3.4,-2.75; 26 3.4,-2.25; 27 3.4,-1.75; 28 3.4,-1.25; 29 3.4,-0.75; 30 3.4,-0.25; 31 3.4,0.25; 32 3.4,0.75; 33 3.4,1.25; 34 3.4,1.75; 35 3.4,2.25; 36 3.4,2.75 | smd 0.25 x 0.7: 13 -2.75,-3.4; 14 -2.25,-3.4; 15 -1.75,-3.4; 16 -1.25,-3.4; 17 -0.75,-3.4; 18 -0.25,-3.4; 19 0.25,-3.4; 20 0.75,-3.4; 21 1.25,-3.4; 22 1.75,-3.4; 23 2.25,-3.4; 24 2.75,-3.4; 37 2.75,3.4; 38 2.25,3.4; 39 1.75,3.4; 40 1.25,3.4; 41 0.75,3.4; 42 0.25,3.4; 43 -0.25,3.4; 44 -0.75,3.4; 45 -1.25,3.4; 46 -1.75,3.4; 47 -2.25,3.4; 48 -2.75,3.4 | smd 5.6 x 5.6: GND 0,0
QFN50P300X300X86-17N = smd 0.8 x 0.25: 1 -1.45,0.75; 2 -1.45,0.25; 3 -1.45,-0.25; 4 -1.45,-0.75; 9 1.45,-0.75; 10 1.45,-0.25; 11 1.45,0.25; 12 1.45,0.75 | smd 0.25 x 0.8: 5 -0.75,-1.45; 6 -0.25,-1.45; 7 0.25,-1.45; 8 0.75,-1.45; 13 0.75,1.45; 14 0.25,1.45; 15 -0.25,1.45; 16 -0.75,1.45 | smd 1.75 x 1.75: EDAP 0,0
SOT65P220X100-6N = smd 0.95 x 0.45: 1 -1.1,0.65; 2 -1.1,0; 3 -1.1,-0.65; 4 1.1,-0.65; 5 1.1,0; 6 1.1,0.65
SOT23-5 = smd 0.55 x 1.2: 1 -0.95,-1.3; 2 0,-1.3; 3 0.95,-1.3; 4 0.95,1.3; 5 -0.95,1.3
CRYSTAL-TCXO-SMD-1.65X1.25 = smd 0.5 x 0.55: 1 -0.7,-0.475; 2 0.7,-0.475; 3 0.7,0.475; 4 -0.7,0.475

### Placement (x,y rotation side)
C1  1.71,9.91 0 top
C2  11.75,14.92 180 top
C3  7.62,10.92 270 top
C4  11.62,10.73 270 top
C5  7.11,23.11 180 top
C6  7.11,22.16 180 top
C7  8.26,27.69 270 top
C8  7.3,27.69 270 top
C9  4.57,26.04 180 top
C10  4.06,24.51 270 top
C11  8.26,29.65 90 top
C12  7.3,29.65 90 top
C13  6.35,29.65 90 top
C14  6.29,37.4 270 top
C15  5.97,35.37 270 top
C16  7.3,37.4 270 top
C17  8.13,25.02 0 top
C18  6.92,35.37 270 top
C19  8.32,37.4 270 top
C20  9.33,30.35 90 top
C21  9.33,32.32 90 top
C22  8.51,39.69 270 top
C23  3.94,40.26 90 top
C24  11.43,27.81 90 top
C25  11.43,30.86 90 top
C26  9.72,16.89 270 top
C27  10.67,16.89 270 top
C28  10.22,39.94 0 top
C29  15.43,30.48 90 top
C30  15.43,38.1 270 top
C31  12.19,39.94 180 top
C32  12.57,16.89 270 top
C33  13.53,16.89 270 top
C34  17.97,27.24 90 top
C35  18.92,27.24 90 top
C36  12.19,42.16 180 top
C37  14.61,43.81 270 top
C38  18.92,22.86 270 top
C39  17.97,22.86 270 top
C40  17.97,25.02 90 top
C41  18.92,24.89 90 top
C42  16.89,42.16 0 top
C43  13.78,34.73 90 top
C44  13.78,37.15 90 top
C45  11.75,13.91 180 top
C46  6.67,8.06 270 top
C47  6.67,13.53 90 top
C48  1.65,14.29 180 top
D1  18.16,44.45 270 top
D2  11.05,44.45 270 top
D3  11.43,4.76 0 top
D4  8.89,44.45 270 top
D5  3.37,19.05 90 top
FD1  17.78,49.53 0 top
FD2  17.78,49.53 0 bottom
FD3  1.27,5.08 0 top
FD4  1.27,5.08 0 bottom
FRAME1  58.42,-10.16 0 top  (outside the outline)
J1  14.61,46.99 270 top
J2  11.43,25.4 0 top
J5  16.51,7.62 180 bottom
JP3  18.16,41.66 90 bottom
JP4  9.65,41.66 90 bottom
JP5  11.43,5.71 180 bottom
JP6  7.37,41.66 90 bottom
K1  5.52,40.39 270 top
L1  11.75,12.89 180 top
L2  7.11,21.21 180 top
L3  6.35,27.69 270 top
L4  5.4,29.65 90 top
L5  8.26,35.69 0 top
L6  9.84,37.91 0 top
L7  11.43,32.64 90 top
L8  11.68,38.23 90 top
L9  8.76,16.89 270 top
L10  11.62,16.89 270 top
L11  15.88,27.94 180 top
L12  15.88,33.02 180 top
L13  19.88,27.24 90 top
L14  19.88,22.86 270 top
L15  19.88,24.89 90 top
LOGO1  31.75,50.8 0 top  (outside the outline)
LOGO2  16.51,6.35 0 top
LOGO3  6.35,6.35 0 bottom
Q1  4.32,15.49 180 top
R1  3.94,5.4 180 top
R2  13.53,14.92 90 top
R3  5.02,35.37 270 top
R4  7.11,20.26 180 top
R5  7.11,19.3 180 top
R6  11.94,29.34 180 top
R7  7.11,39.69 90 top
R8  7.11,18.35 0 top
R9  7.05,44.45 270 top
R10  6.67,15.56 90 top
R11  13.53,12.95 270 top
R12  16.51,43.81 270 top
R13  12.7,43.81 270 top
R14  13.78,32.26 270 top
R15  11.43,7.62 0 top
R16  4.25,9.91 180 top
R17  13.78,29.84 90 top
SPARKX1  11.43,2.54 0 top
SPARKX2  11.43,2.54 0 bottom
TP1  8.89,8.89 0 top
TP2  8.89,13.97 0 top
TP3  13.97,11.43 0 top
TP4  7.62,33.02 0 top
U1  17.14,13.97 0 top
U2  9.72,10.73 270 top
U3  13.21,22.73 90 top
U4  11.18,35.43 90 top
U5  14.61,41.02 90 top
U6  6.03,32.83 270 top
U7  3.81,7.62 270 top
U8  3.81,12.06 270 top
U$1  [#TX#0]  19.68,44.45 90 top
U$2  [#RX#0]  11.05,47.43 90 top
U$3  [#RX_LED#0]  9.59,45.72 270 bottom
U$4  [#TX_LED#0]  17.84,45.78 270 bottom
U$5  [#RF_LED#0]  7.37,45.66 270 bottom
U$6  [#G8#0]  3.81,39.37 0 bottom
U$7  [#RF#0]  8.89,47.37 90 top
U$8  [#RF_EN#0]  4.95,24.13 0 bottom
U$9  [CIPO#0]  18.61,36.83 0 bottom
U$10  [#CIPO0]  18.61,36.83 0 top
U$11  [#COPI0]  18.61,34.29 0 top
U$12  [COPI#0]  18.61,34.29 0 bottom
U$13  [#SCLK0]  18.54,31.75 0 top
U$14  [SCLK#0]  18.54,31.75 0 bottom
U$15  [#CS0]  19.43,29.21 0 top
U$16  [CS#0]  19.43,29.21 0 bottom
U$17  [GND#0]  18.86,13.97 0 bottom
U$18  [#RESETB0]  5.4,29.21 0 bottom
U$19  [#PWR_EN0]  5.33,26.67 0 bottom
U$20  [#VBATT#0]  5.65,16.51 0 bottom
U$21  [#VUSB#0]  4.89,21.59 0 bottom
U$24  [#BOOT0]  4.7,36.83 0 bottom
U$25  [#INT10]  4.13,34.29 0 bottom
U$26  [#INT20]  4.25,31.75 0 bottom
U$27  [#PWR_LED#0]  11.43,7.62 0 bottom
U$28  [#PWR#0]  11.49,6.35 0 top
U$29  [ARTIC_R2_BREAKOUT0]  11.43,24.13 90 bottom
X1  5.84,24.51 0 top

### Tracks (layer width: path | path; a pad name or v marks a point on that pad's centre or on a via)
1.8V  (via drill 0.2)
  Top 0.254: v5.4,30.86 L4.2 | L2.2 6.1,21.21 5.84,21.47 v5.84,21.65 | L9.2 v8.76,15.68 | L14.2 19.88,21.53 v19.37,21.02 | L13.2 19.88,28.32 v18.92,29.27
  Top 0.61: U2.5 10.69,11.23 C4.1 v12.7,11.23 13.77,11.23 TP3.P$1
  Bottom 0.508: 5.08,21.65 v5.84,21.65 6.22,21.65 6.69,22.12 17.37,22.12 18.48,21.02 v19.37,21.02 | 5.08,25.02 8.7,25.02 9.14,24.57 16.19,24.57 17.46,25.84 17.46,27.81 v18.92,29.27
  Bottom 0.61: v5.4,30.86 5.43,30.82 5.43,26.55 5.08,26.19 5.08,25.02 5.08,21.65 5.08,17.97 7.37,15.68 v8.76,15.68 9.84,14.61 9.84,13.14 11.76,11.23 v12.7,11.23 13.77,11.23 TP3.P$1
ANTENNA
  Top 0.305: C37.1 J1.FEED
ARTIC_PWR_EN  (via drill 0.2)
  Top 0.254: U7.3 v2.51,5.78 2.51,5.62 2.73,5.4 R1.2
  Bottom 0.254: J2.8 3.05,24.89 3.05,16.83 5.27,14.61 5.27,7.81 3.24,5.78 v2.51,5.78
BOOT  (via drill 0.2)
  Top 0.254: U3.46 8.98,20.98 8.7,20.7 v8.7,20.19 7.81,19.3 R5.1
  Route15 0.254: v8.7,20.19 8.67,20.19 8.5,20.02 4.24,20.02 3.87,20.38 3.87,34.23 J2.4
CIPO  (via drill 0.2)
  Top 0.254: U3.5 12.46,18.55 v12.45,18.54
  Route15 0.203: v12.45,18.54 12.7,18.8 13.72,18.8 14.94,20.02 14.94,20.52 15.3,20.89 16.19,20.89 18.73,23.43 18.73,27.43 19.56,28.26 19.56,30.8 20.13,31.37 20.13,35.5 21.46,36.83 J2.16
COPI  (via drill 0.2)
  Top 0.254: U3.4 11.96,18.56 v11.94,18.54
  Route15 0.203: v11.94,18.54 11.94,18.83 12.26,19.15 13.56,19.15 14.61,20.19 14.61,21.57 15.11,22.07 16.89,22.07 18.39,23.57 18.39,31.85 19.05,32.51 v19.05,33.27
  Bottom 0.203: J2.17 21.27,34.29 20.26,33.27 v19.05,33.27
CS  (via drill 0.2)
  Top 0.254: U3.2 10.96,18.58 v10.92,18.54 | v17.59,29.97 20.83,29.97 J2.19
  Route15 0.203: v10.92,18.54 10.92,19.05 11.68,19.81 12.7,19.81 13.08,20.19 13.08,23.62 14.03,24.57 16.7,24.57 17.59,25.46 v17.59,29.97
FLSH_CEN  (via drill 0.2)
  Top 0.254: v17.4,20.95 17.37,20.98 U3.15 | v15.24,12.38 U1.1 15.24,10.29 15.49,10.03 17.91,10.03 J5.5
  Bottom 0.254: v15.24,12.38 15.24,18.8 v17.4,20.95
FLSH_SCLK  (via drill 0.2)
  Top 0.254: U3.12 16.86,19.33 17.78,18.41 v17.78,17.78 U1.6
  Bottom 0.254: J5.3 17.14,9.53 17.14,17.14 v17.78,17.78
FLSH_SI  (via drill 0.2)
  Top 0.254: U3.13 17.16,19.98 19.05,18.1 v19.05,17.78 U1.5
  Bottom 0.254: J5.4 17.78,7.62 17.78,13.59 18.41,14.22 18.41,17.14 v19.05,17.78
FLSH_SO  (via drill 0.2)
  Top 0.254: v17.53,20.45 16.64,20.45 U3.14 | U1.2 v16.51,12.38
  Bottom 0.254: v17.53,20.45 16.51,19.43 v16.51,12.38 16.51,11.43 J5.1
FLSH_VCC
  Top 0.254: U1.8 15.24,15.81 14.85,15.42 R2.2 13.21,15.42 12.71,14.92 C2.1 C45.1 L1.1 12.77,12.89 13.21,12.45 R11.2 14.09,12.45 14.61,11.94 14.61,10.03 15.18,9.46 15.18,7.56 J5.2
G8  (via drill 0.2)
  Top 0.254: v5.91,42.29 5.92,42.27 K1.1
  Bottom 0.254: J2.3 4.19,42.29 v5.91,42.29
GND  (via drill 0.2)
  Top 0.254: v14.61,27.3 14.61,27.24 14.96,26.89 U3.27 14.96,25.49 15.3,25.15 v15.62,25.15 15.96,25.48 U3.25 15.96,26.63 v16.13,26.8 | U4.2 10.93,33.53 10.54,33.15 | X1.2 6.64,24.13 v8.26,24.13 8.89,24.13 9.24,24.48 U3.39 10.51,24.48 10.79,24.19 v10.79,24 | X1.2 6.45,24.13 v5.84,24.13 5.24,24.13 X1.1 5.12,24.01 C10.2 | C34.2 C35.2 v18.92,28.46 | C40.2 18.8,25.52 C41.2 18.92,25.84 19.14,26.05 v19.88,26.05 | C39.2 C38.2 v18.92,21.65 | X1.2 6.54,23.18 C5.2 C6.2 5.97,22.16 v5.84,22.29 | v14.03,27.3 13.84,27.11 13.84,26.62 13.96,26.5 U3.29 13.96,25.16 v13.97,25.15 13.72,25.15 13.46,25.4 U3.30 13.46,26.93 v13.08,27.3 12.96,27.18 U3.31 12.96,25.4 12.7,25.15 v12.45,25.15 v12.46,25.16 U3.32 12.46,27.1 12.45,27.11 | C45.2 10.79,13.91 10.54,14.16 v10.54,14.41 10.54,14.67 10.79,14.92 C2.2 | C9.2 4.07,26.49 4.38,26.8 v4.76,26.8 | R4.2 6.29,20.26 5.84,20.71 v5.84,20.77 | v2.92,30.73 2.59,30.4 2.59,23.42 v2.03,22.86 | v5.71,32.83 U6.2
  Top 0.305: v9.72,39.18 9.08,38.54 7.81,38.54 v7.75,38.61 7.68,38.54 v5.52,38.54
  Top 0.406: v14.61,27.3 U5.2 14.61,40.77 v14.86,41.02 15.62,41.02 16.31,40.34 L12.P$1 L11.P$1 16.31,26.98 v16.13,26.8 | 12.45,27.11 R6.1 12.44,33.14 12.7,33.4 v12.7,34.04 | 10.54,33.15 v10.54,27.3 | v9.46,10.73 U2.2 v8.26,10.73 7.93,10.73 C3.2
  Top 0.61: C19.2 C16.2 C14.2 5.53,36.9 v5.46,36.83
  Bottom 0.254: JP5.1 v9.78,5.71 | v2.92,30.73 3.5,30.15 3.5,17.13 5.84,14.8 v5.84,14.03
  other vias: 14.61,31.75 14.61,30.48 14.61,29.21 14.61,27.94 16.32,28.57 16.32,27.3 15.49,41.02 16,40.51 16.32,31.11 16.32,32.38 16.32,40.01 15.62,22.73 15.62,24 13.97,22.73 12.45,22.73 10.79,22.73 10.79,25.15 10.79,20.32 12.45,20.32 13.97,20.32 15.62,20.32 15.62,21.46 10.79,21.46 16.32,29.84 16.32,33.66 16.32,34.92 14.61,33.02 14.61,34.29 16.32,36.2 16.32,37.47 14.61,35.56 14.61,36.83 16.32,38.73 14.61,38.1 12.45,27.24 12.45,28.57 12.45,30.48 12.45,31.75 12.45,33.02 10.54,33.02 10.54,31.75 10.54,30.48 10.54,29.21 10.54,27.94 14.61,39.12 12.7,36.83 12.45,37.47 12.7,39.12 13.78,38.42 10.92,38.42 12.45,38.23 8.51,41.08 12.7,40.64 10.73,39.18 13.34,40.64 13.34,41.4 18.16,40.39 13.72,43.18 13.72,44.45 13.59,45.21 15.49,44.45 15.49,43.18 15.62,45.21 12.95,45.47 16.26,45.47 16.89,46.35 16.89,47.62 12.32,46.35 12.32,47.62 12.83,48.77 13.97,49.53 15.24,49.53 16.38,48.77 10.86,42.16 17.08,41.53 10.67,35.43 11.18,35.94 11.68,35.43 11.18,34.92 11.18,35.43 3.81,44.45 5.08,42.74 5.08,45.72 19.05,12.7 9.97,15.62 12.51,15.68 11.62,9.53 7.3,26.48 8.26,26.48 6.35,30.86 7.81,30.92 11.68,40.64 10.86,41.08 11.68,41.4 7.11,41.08 13.78,38.93 7.68,34.86 7.62,46.99 6.35,43.18 4.32,41.59 3.24,38.1 9.33,33.66 10.16,46.99 7.81,40.2 20.32,17.78 7.62,9.72 19.05,38.1 19.05,36.83 19.05,34.29 19.37,31.75 20.45,30.67 12.7,10.29 19.05,15.24 1.27,7.62 7.62,5.08 6.67,6.79 5.08,3.81 3.56,7.62 3.56,12.06 5.97,12.06 5.27,5.4 17.78,15.24 15.88,13.97 1.14,13.59 19.05,19.68 3.17,33.91 2.92,36.39 8.89,46.99 20.19,28.89 20.83,33.02 21.02,35.56 2.54,43.18 17.78,3.81 7.62,14.92 15.88,17.78 6.35,46.99 5.84,9.91 2.98,9.91 13.78,33.46
  cutout Route2 (isolate 0.305): 14.86,38.1 16,38.1 16,27.05 15.75,26.8 15.75,25.65 15.11,25.65 15.11,26.92 14.86,27.18
  pour Top (isolate 0.254, rank 3): 0,50.8 22.86,50.8 22.86,0 0,0
  pour Route2 (isolate 0.203, rank 2): 0,50.8 22.86,50.8 22.86,0 0,0
  pour Route15 (isolate 0.254, rank 2): 0,50.8 22.86,50.8 22.86,0 0,0
  pour Bottom (isolate 0.254, rank 2): 0,50.8 22.86,50.8 22.86,0 0,0
  pour Top (isolate 0.102): 10.29,34.29 12.7,34.29 12.7,25.4 10.29,25.4
  pour Top (isolate 0.102, rank 2): 14.41,38.1 16.51,38.1 16.51,25.4 14.41,25.4
  pour Top (isolate 0.102): 10.92,49.53 16.51,49.53 16.51,34.29 10.92,34.29
INT1  (via drill 0.2)
  Top 0.254: U3.47 9.24,20.48 9.14,20.38 v9.14,19.68
  Route15 0.254: v9.14,19.68 9.02,19.56 4,19.56 3.43,20.13 3.43,32.13 J2.5
INT2  (via drill 0.2)
  Top 0.254: U3.48 9.78,19.95 9.78,19.56 v9.4,19.18
  Route15 0.254: v9.4,19.18 9.34,19.11 3.75,19.11 2.98,19.88 2.98,30.04 J2.6
N$2
  Top 0.254: R2.1 15.12,14.42 16.51,15.81 U1.7
N$3
  Top 0.254: U1.3 17.78,12.32 16.64,13.45 R11.1
N$4
  Top 0.254: U3.24 16.61,25.82 17.53,26.74 C34.1 C35.1 L13.1
N$5
  Top 0.254: L15.1 C41.1 18.8,24.52 C40.1 17.93,24.52 17.45,24.99 17.09,24.99 17.08,24.98 U3.23
N$6
  Top 0.254: R13.1 11.69,45.33 D2.A
N$7
  Top 0.254: R12.1 17.52,45.33 D1.A
N$8
  Top 0.254: L9.1 C26.1 C27.1 10.67,17.84 10.86,18.03 12.76,18.03 12.96,18.23 U3.6
N$9  (via drill 0.2)
  Top 0.254: L10.1 C32.1 C33.1 13.91,17.39 v14.45,17.93 14.46,17.94 U3.9 | R5.2 R8.1 6.61,17.84 6.8,17.65 7.97,17.65 8.41,18.1 v9.21,18.1
  Bottom 0.254: v14.45,17.93 14.45,17.88 14.41,17.84 9.46,17.84 v9.21,18.1
N$10  (via drill 0.2)
  Top 0.254: L4.1 C13.1 C12.1 C11.1 8.95,29.15 9.84,28.26 9.84,27.05 10.1,26.8 v10.67,26.8 10.96,26.51 U3.35 | U3.28 14.46,26.74 v14.33,26.86 | U3.33 11.96,26.74 v12.01,26.8
  Bottom 0.254: v14.33,26.86 14.27,26.8 v12.01,26.8 v10.67,26.8
N$11
  Top 0.254: L3.1 C8.1 C7.1 8.58,28.19 9.34,27.43 9.34,26.42 9.62,26.13 U3.36
N$12
  Top 0.254: U3.41 9.35,23.48 8.32,22.45 8.32,20.51 8.06,20.26 R4.1
N$13
  Top 0.254: L2.1 C6.1 C5.1 8.45,23.11 9.31,23.98 U3.40
N$14
  Top 0.254: U3.37 9.31,25.48 9.08,25.72 5.9,25.72 5.58,26.04 C9.1 5.14,25.96 X1.4 5.12,25.01 C10.1
N$15
  Top 0.254: X1.3 7.59,24.99 C17.1
N$16
  Top 0.254: U3.38 8.66,24.98 C17.2
N$17
  Top 0.254: U3.34 11.46,27.29 C24.1
N$18
  Top 0.254: R6.2 | C25.1
  Top 0.305: C24.2 R6.2 | R6.2 C25.1
N$19
  Top 0.254: L5.P$2 U4.14
N$20
  Top 0.254: R3.1 C15.1 C18.1 7.63,35.88 L5.P$1
N$21
  Top 0.254: C29.P$1 15.44,30.07 15.43,30.05 15.44,30.05 15.44,30.04 | 15.46,27.93 L11.P$2 arc-45 L11.P$2 | U3.26 15.46,27.1 15.44,27.11
  Top 0.508: 15.44,27.11 L11.P$2 | L11.P$2 15.44,30.05
N$22
  Top 0.254: D4.A 7.43,45.33 R9.1
N$24
  Top 0.305: C25.2 L7.P$1
N$25
  Top 0.254: L7.P$2 U4.3
N$26
  Top 0.254: U4.10 11.68,36.88 U4.9 | L8.P$1 10.39,37.8 L6.P$2
  Top 0.305: L8.P$1 11.68,36.88
N$27  (via drill 0.2)
  Top 0.254: D4.C 8.08,43.57 v7.75,43.24
  Bottom 0.254: v7.75,43.24 7.37,42.86 JP6.2
N$28
  Top 0.254: U5.1
  Top 0.305: C31.1 12.71,39.92 U5.1
N$29
  Top 0.254: C30.1 15.45,38.62
  Top 0.305: U5.3 15.26,39.6 15.45,39.41 15.45,38.62
N$30
  Top 0.305: U5.5 C37.2
N$31
  Top 0.254: U3.20 17.85,23.48 C39.1 C38.1 L14.1
N$35  (via drill 0.2)
  Top 0.254: D1.C v18.16,42.8
  Bottom 0.254: v18.16,42.8 JP3.2
N$36  (via drill 0.2)
  Top 0.254: D2.C 10.68,43.57 v10.1,42.99
  Bottom 0.254: v10.1,42.99 9.97,42.99 9.65,42.67 JP4.2
N$37
  Top 0.254: R15.1 10.93,6.73 10.55,6.35 D3.A
N$38  (via drill 0.2)
  Top 0.254: v13.34,5.08 13.02,4.76 D3.C
  Bottom 0.254: v13.34,5.08 13.34,5.4 13.02,5.71 JP5.2
PA_PD  (via drill 0.2)
  Top 0.254: U3.7 13.46,18.73 13.85,18.34 v13.85,18.29 | v13.78,28.57 R17.1
  Route15 0.203: v13.85,18.29 13.08,18.29 12.89,18.1 10.67,18.1 10.48,18.29 10.48,19.11 11.75,20.38 11.75,25.27 13.53,27.05 13.53,27.88 13.53,28.32 v13.78,28.57
PD  (via drill 0.2)
  Top 0.254: U4.6 13.73,35.18 C43.2 | C44.1 v13.78,35.94 C43.2 | C43.2 13.59,35.23 | R17.2 v13.78,31.05 R14.2
  Route15 0.254: v13.78,31.05 13.27,31.56 13.27,35.43 v13.78,35.94
RESETB  (via drill 0.2)
  Top 0.254: U3.1 10.46,19.03 10.1,18.67 v9.4,18.67 7.93,18.67 R8.2
  Route15 0.254: v9.4,18.67 3.49,18.67 2.54,19.62 2.54,27.94 J2.7
RF_PWR_EN  (via drill 0.2)
  Top 0.254: U8.3 v3.78,11.11 3.78,9.93 R16.2
  Bottom 0.254: J2.9 1.59,24.13 2.65,23.07 2.65,16.59 4.83,14.41 4.83,11.84 4.1,11.11 v3.78,11.11
RF_RX
  Top 0.508: C29.P$2 15.44,30.89 L12.P$2 15.44,37.59 C30.2
RF_TX
  Top 0.305: L8.P$2 C31.2 C28.2
RFG8  (via drill 0.2)
  Top 0.254: U4.12 10.11,36.88 v9.91,37.08 | C22.2 v7.82,39.19 | v7.82,39.19 R7.1 6.17,39.19 K1.4 | v7.82,39.19 v7.81,39.18
  Bottom 0.254: v9.91,37.08 v7.81,39.18
RXSW  (via drill 0.2)
  Top 0.254: U5.6 13.91,42.16 v13.4,42.16 C36.1 R13.2 | U3.22 17.21,24.48 v17.27,24.55
  Bottom 0.203: v17.27,24.55 18.16,25.43 18.16,27.06 19.41,28.31 19.41,29.93 17.14,32.19 17.14,40.13 15.11,42.16 v13.4,42.16
SCLK  (via drill 0.2)
  Top 0.254: U3.3 11.46,18.57 v11.43,18.54
  Route15 0.203: v11.43,18.54 11.43,19.05 11.86,19.48 12.84,19.48 13.41,20.06 13.41,22.98 13.85,23.42 17.28,23.42 18.06,24.2 18.06,32.28 v18.54,32.77
  Bottom 0.254: J2.18 21.27,31.75 20.26,32.77 v18.54,32.77
TXSW  (via drill 0.2)
  Top 0.254: U5.4 v15.81,42.12 16.35,42.12 C42.1 16.39,43.2 R12.2 | U3.21 16.63,24 v17.27,24
  Bottom 0.203: v17.27,24 17.28,24.01 17.44,24.01 18.54,25.12 18.54,26.91 19.74,28.11 19.74,30.07 17.48,32.33 17.48,40.39 15.81,42.06 v15.81,42.12
V_BATT  (via drill 0.2)
  Top 0.61: Q1.3 3.54,14.39 v3.3,14.16 v3.3,14.73
  Bottom 0.61: v3.3,14.16 v3.3,14.73 1.52,16.51 J2.12
V_USB
  Top 0.254: R10.2 5.71,16.06 Q1.1
  Top 0.61: J2.10 2.86,21.59 3.37,21.08 D5.A 4.7,18.87 4.7,17.06 Q1.1
VDD  (via drill 0.2)
  Top 0.203: U2.1 9.7,11.38 9.91,11.18 9.91,10.29 9.7,10.08 U2.3
  Top 0.254: L1.2 11.43,12.71 | 9.65,14.48 9.65,14.54 10.79,15.68 11.49,15.68 11.62,15.81 L10.2 | R15.2 11.93,8.38 11.42,8.89 TP1.P$1
  Top 0.305: L15.2 v20.44,25.39 v20.45,25.4
  Top 0.406: U2.1 7.66,11.38 C3.1
  Top 0.61: C3.1 | U7.5 C46.1 | C46.1 6.67,11.24 6.85,11.42 C3.1 | C3.1 7.62,12.19 8.32,12.89 9.78,12.89 | 9.78,12.89 L1.2 | 9.78,12.89 9.84,12.95 9.84,14.29 9.65,14.48 9.08,15.05 8.51,15.05 7.75,15.81 7.75,16.64 7.29,17.09 6.46,17.09 5.71,17.84 5.71,19.78 5.08,20.41 5.08,22.73 | L3.2 5.61,27.19 5.01,27.79 4.29,27.79 3.24,26.73 3.24,23.3 3.81,22.73 5.08,22.73 | TP1.P$1 8.56,8.56 C46.1 | v5.84,23.18 5.52,23.18 5.08,22.73
  Bottom 0.508: v5.84,23.18 6.06,23.39 17.74,23.39 19.75,25.4 v20.45,25.4
VDDA  (via drill 0.2)
  Top 0.254: R9.2 5.15,43.95 3.17,41.97 3.17,39.18 4.86,37.5
  Top 0.305: C19.1 | 9.22,37.91 L6.P$1
  Top 0.406: U6.3 5.91,31.88 6.29,32.26 6.29,33.4 5.91,33.78 U6.1
  Top 0.508: R3.2 5.02,34.06 U6.1 | v4.45,30.99 4.45,31.59 U6.3
  Top 0.61: U8.5 6.66,13.02 C47.1 7.18,13.03 v8.13,13.97 TP2.P$1 | R3.2 4.12,34.87 3.81,35.18 3.81,36.45 4.86,37.5 5.26,37.9 C14.1 C16.1 C19.1 9.22,37.91
  Bottom 0.61: v4,34.99 4.45,34.54 v4.45,30.99 4.45,27.56 4.06,27.18 4.06,17.53 7.62,13.97 v8.13,13.97 TP2.P$1
VIN
  Top 0.61: U8.1 2.1,13.02 | 2.1,13.02 1.65,13.02 1.21,12.57 C1.1 1.21,9.9 1.21,8.95 1.59,8.57 U7.1 | D5.C Q1.2 3.37,16.26 2.15,15.04 C48.1 2.15,13.07 2.1,13.02
VREF1  (via drill 0.2)
  Top 0.254: K1.3 4.26,39.44 C23.1 | v9.46,36.77 9.73,36.5 U4.13 | U4.16 8.52,34.68 v8.51,34.67
  Top 0.406: 8.51,33.78 U6.5 7.33,33.31 TP4.P$1 | 8.51,33.78 8.51,32.83 | 8.51,32.83 8.51,31.13 8.79,30.85 C20.2 | 8.51,33.78 v8.51,34.67 | C21.2 8.52,32.82 8.51,32.83 | v4.57,38.48 5.12,39.03 K1.3
  Bottom 0.406: v4.57,38.48 5.08,37.97 8.26,37.97 v9.46,36.77 8.51,35.81 v8.51,34.67 8.51,33.91 TP4.P$1

### Text on the board
Top: TOP
Route2: 2
Route15: 15
Bottom: X03 | BOT
tDocu: JLCPCB JLC7628 4-Layer 0.8mm Impedance Control / 4-Layer Board / 0.8mm Thickness / 1oz Copper (Outer layers) / ENIG Finish | Paul Clark